# EAGLE schematic anchor (EAGLE 6.5.0)
AUTHOR: Brad Campbell; REV: A; TITLE: PolyAnchor

## Sheet 1 of 2
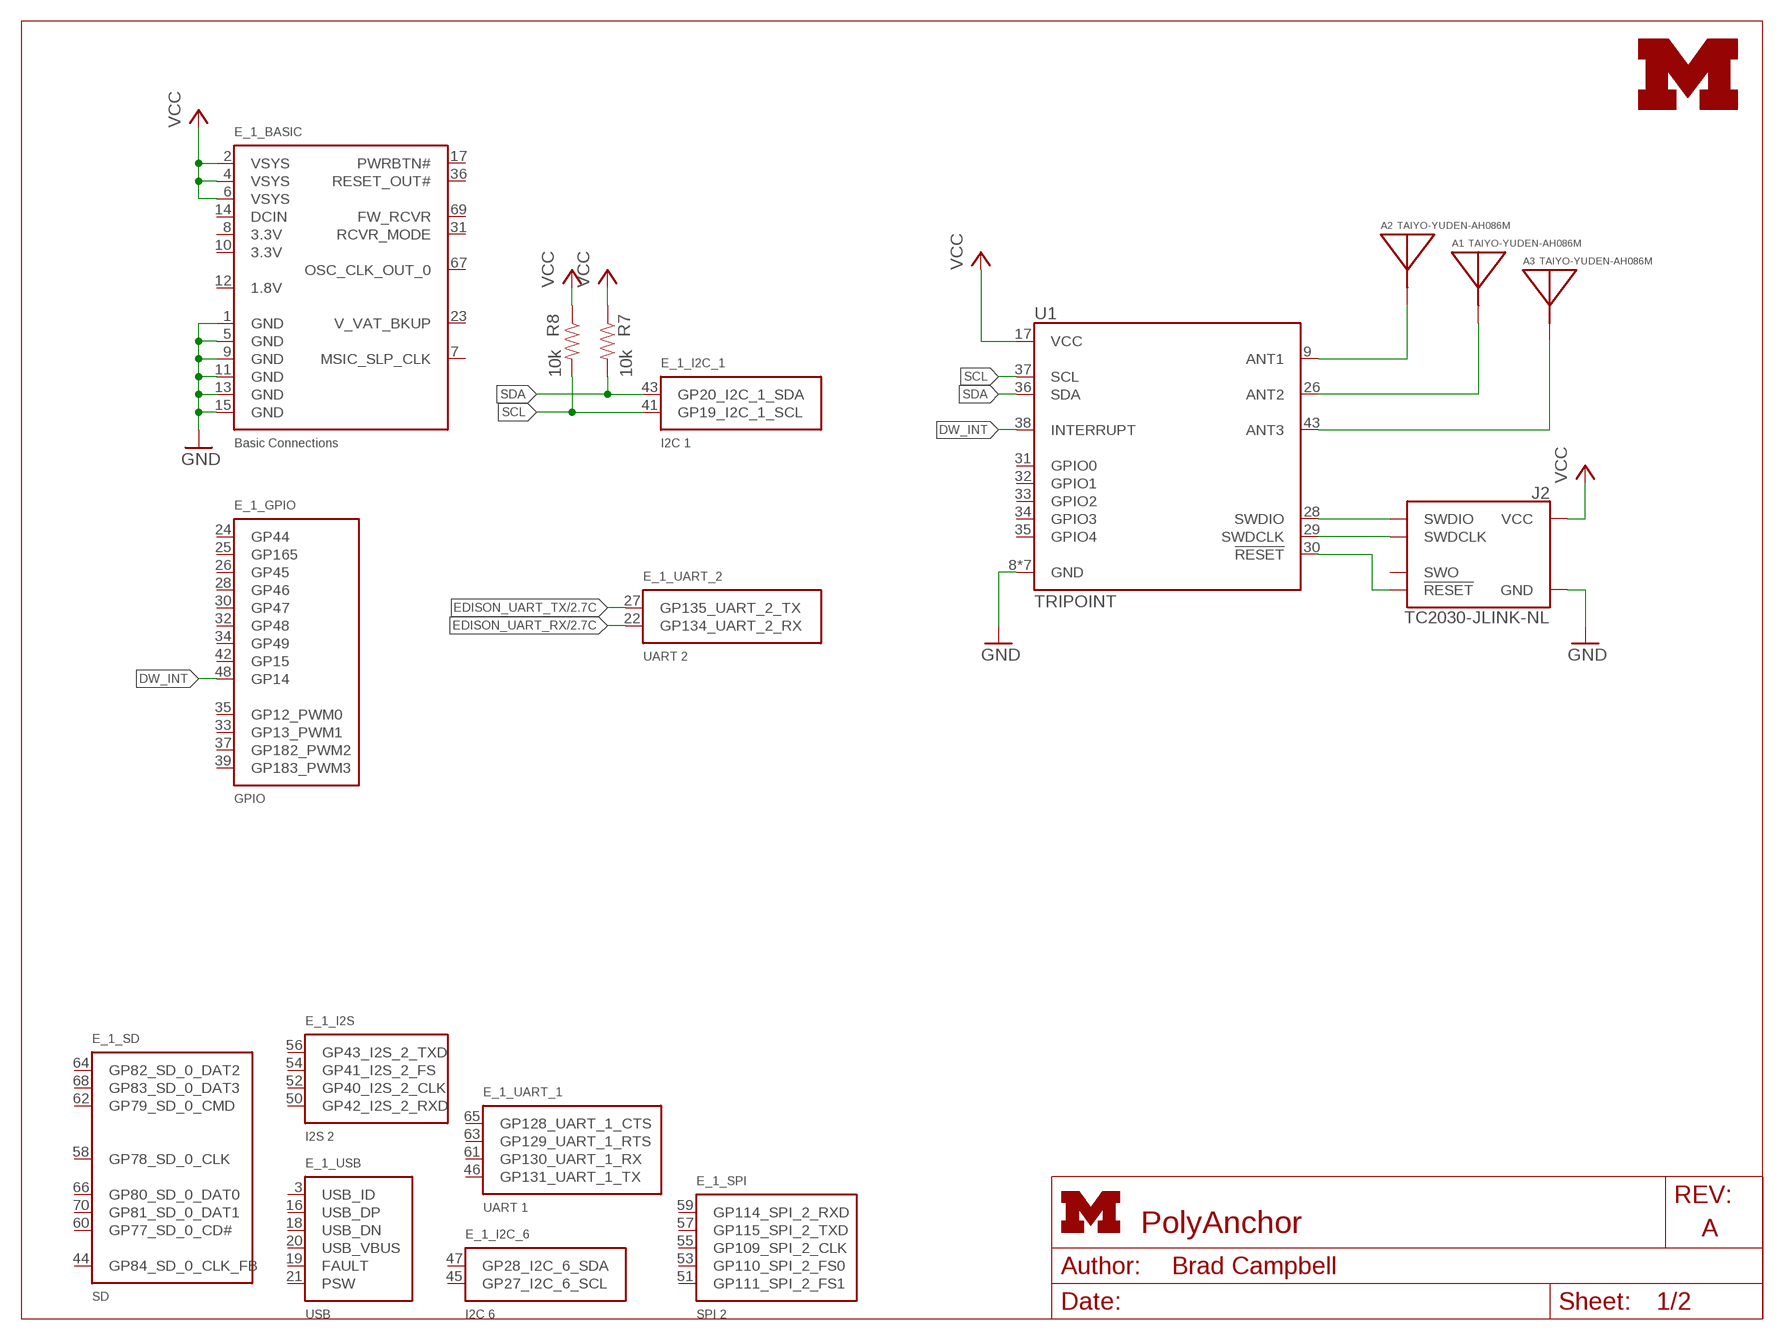
[diagram p0: schematic, sheet 1]
FRAME1 (LETTER_L): HEIGHT: 8.5in; WIDTH: 11in

### Parts
A1  TAIYO-YUDEN-AH086M  [TAIYO-YUDEN-AH086M]
A2  TAIYO-YUDEN-AH086M  [TAIYO-YUDEN-AH086M]
A3  TAIYO-YUDEN-AH086M  [TAIYO-YUDEN-AH086M]
E_1  EDISON_CONNECTOR_SEGMENTED  [EDISON_DAUGHTER]
J2  TC2030-JLINK-NL  [TC2030-IDC-NL]
LOGO1  UMICH_SOLID_MEDIUM  [UMICH_SOLID_200MIL]
R7  10k  RESISTOR0402_RES  [0402_RES]
R8  10k  RESISTOR0402_RES  [0402_RES]
U1  TRIPOINT  [TRIPOINT]

### Nets
DW_INT: E_1.48(_GPIO:GP14) U1.38(INTERRUPT)
EDISON_UART_RX: E_1.22(_UART_2:GP134_UART_2_RX) ; also sheet 2
EDISON_UART_TX: E_1.27(_UART_2:GP135_UART_2_TX) ; also sheet 2
GND: E_1.1(_BASIC:GND) E_1.5(_BASIC:GND) E_1.9(_BASIC:GND) E_1.11(_BASIC:GND) E_1.13(_BASIC:GND) E_1.15(_BASIC:GND) J2.5(GND) U1.8(GND) U1.10(GND) U1.18(GND) U1.25(GND) U1.27(GND) U1.42(GND) U1.44(GND) ; also sheet 2
N$5: J2.2(SWDIO) U1.28(SWDIO)
N$10: A2.A(ANTENNA) U1.9(ANT1)
N$11: A1.A(ANTENNA) U1.26(ANT2)
N$12: A3.A(ANTENNA) U1.43(ANT3)
N$13: J2.4(SWDCLK) U1.29(SWDCLK)
N$14: J2.3(!RESET) U1.30(!RESET)
SCL: E_1.41(_I2C_1:GP19_I2C_1_SCL) R8.2 U1.37(SCL)
SDA: E_1.43(_I2C_1:GP20_I2C_1_SDA) R7.2 U1.36(SDA)
VCC: E_1.2(_BASIC:VSYS) E_1.4(_BASIC:VSYS) E_1.6(_BASIC:VSYS) J2.1(VCC) R7.1 R8.1 U1.17(VCC) ; also sheet 2
Unconnected: E_1.3(_USB:USB_ID) E_1.7(_BASIC:MSIC_SLP_CLK) E_1.8(_BASIC:3.3V) E_1.10(_BASIC:3.3V) E_1.12(_BASIC:1.8V) E_1.14(_BASIC:DCIN) E_1.16(_USB:USB_DP) E_1.17(_BASIC:PWRBTN#) E_1.18(_USB:USB_DN) E_1.19(_USB:FAULT) E_1.20(_USB:USB_VBUS) E_1.21(_USB:PSW) E_1.23(_BASIC:V_VAT_BKUP) E_1.24(_GPIO:GP44) E_1.25(_GPIO:GP165) E_1.26(_GPIO:GP45) E_1.28(_GPIO:GP46) E_1.30(_GPIO:GP47) E_1.31(_BASIC:RCVR_MODE) E_1.32(_GPIO:GP48) E_1.33(_GPIO:GP13_PWM1) E_1.34(_GPIO:GP49) E_1.35(_GPIO:GP12_PWM0) E_1.36(_BASIC:RESET_OUT#) E_1.37(_GPIO:GP182_PWM2) E_1.39(_GPIO:GP183_PWM3) E_1.42(_GPIO:GP15) E_1.44(_SD:GP84_SD_0_CLK_FB) E_1.45(_I2C_6:GP27_I2C_6_SCL) E_1.46(_UART_1:GP131_UART_1_TX) E_1.47(_I2C_6:GP28_I2C_6_SDA) E_1.50(_I2S:GP42_I2S_2_RXD) E_1.51(_SPI:GP111_SPI_2_FS1) E_1.52(_I2S:GP40_I2S_2_CLK) E_1.53(_SPI:GP110_SPI_2_FS0) E_1.54(_I2S:GP41_I2S_2_FS) E_1.55(_SPI:GP109_SPI_2_CLK) E_1.56(_I2S:GP43_I2S_2_TXD) E_1.57(_SPI:GP115_SPI_2_TXD) E_1.58(_SD:GP78_SD_0_CLK) E_1.59(_SPI:GP114_SPI_2_RXD) E_1.60(_SD:GP77_SD_0_CD#) E_1.61(_UART_1:GP130_UART_1_RX) E_1.62(_SD:GP79_SD_0_CMD) E_1.63(_UART_1:GP129_UART_1_RTS) E_1.64(_SD:GP82_SD_0_DAT2) E_1.65(_UART_1:GP128_UART_1_CTS) E_1.66(_SD:GP80_SD_0_DAT0) E_1.67(_BASIC:OSC_CLK_OUT_0) E_1.68(_SD:GP83_SD_0_DAT3) E_1.69(_BASIC:FW_RCVR) E_1.70(_SD:GP81_SD_0_DAT1) J2.6(SWO) U1.31(GPIO0) U1.32(GPIO1) U1.33(GPIO2) U1.34(GPIO3) U1.35(GPIO4)

## Sheet 2 of 2
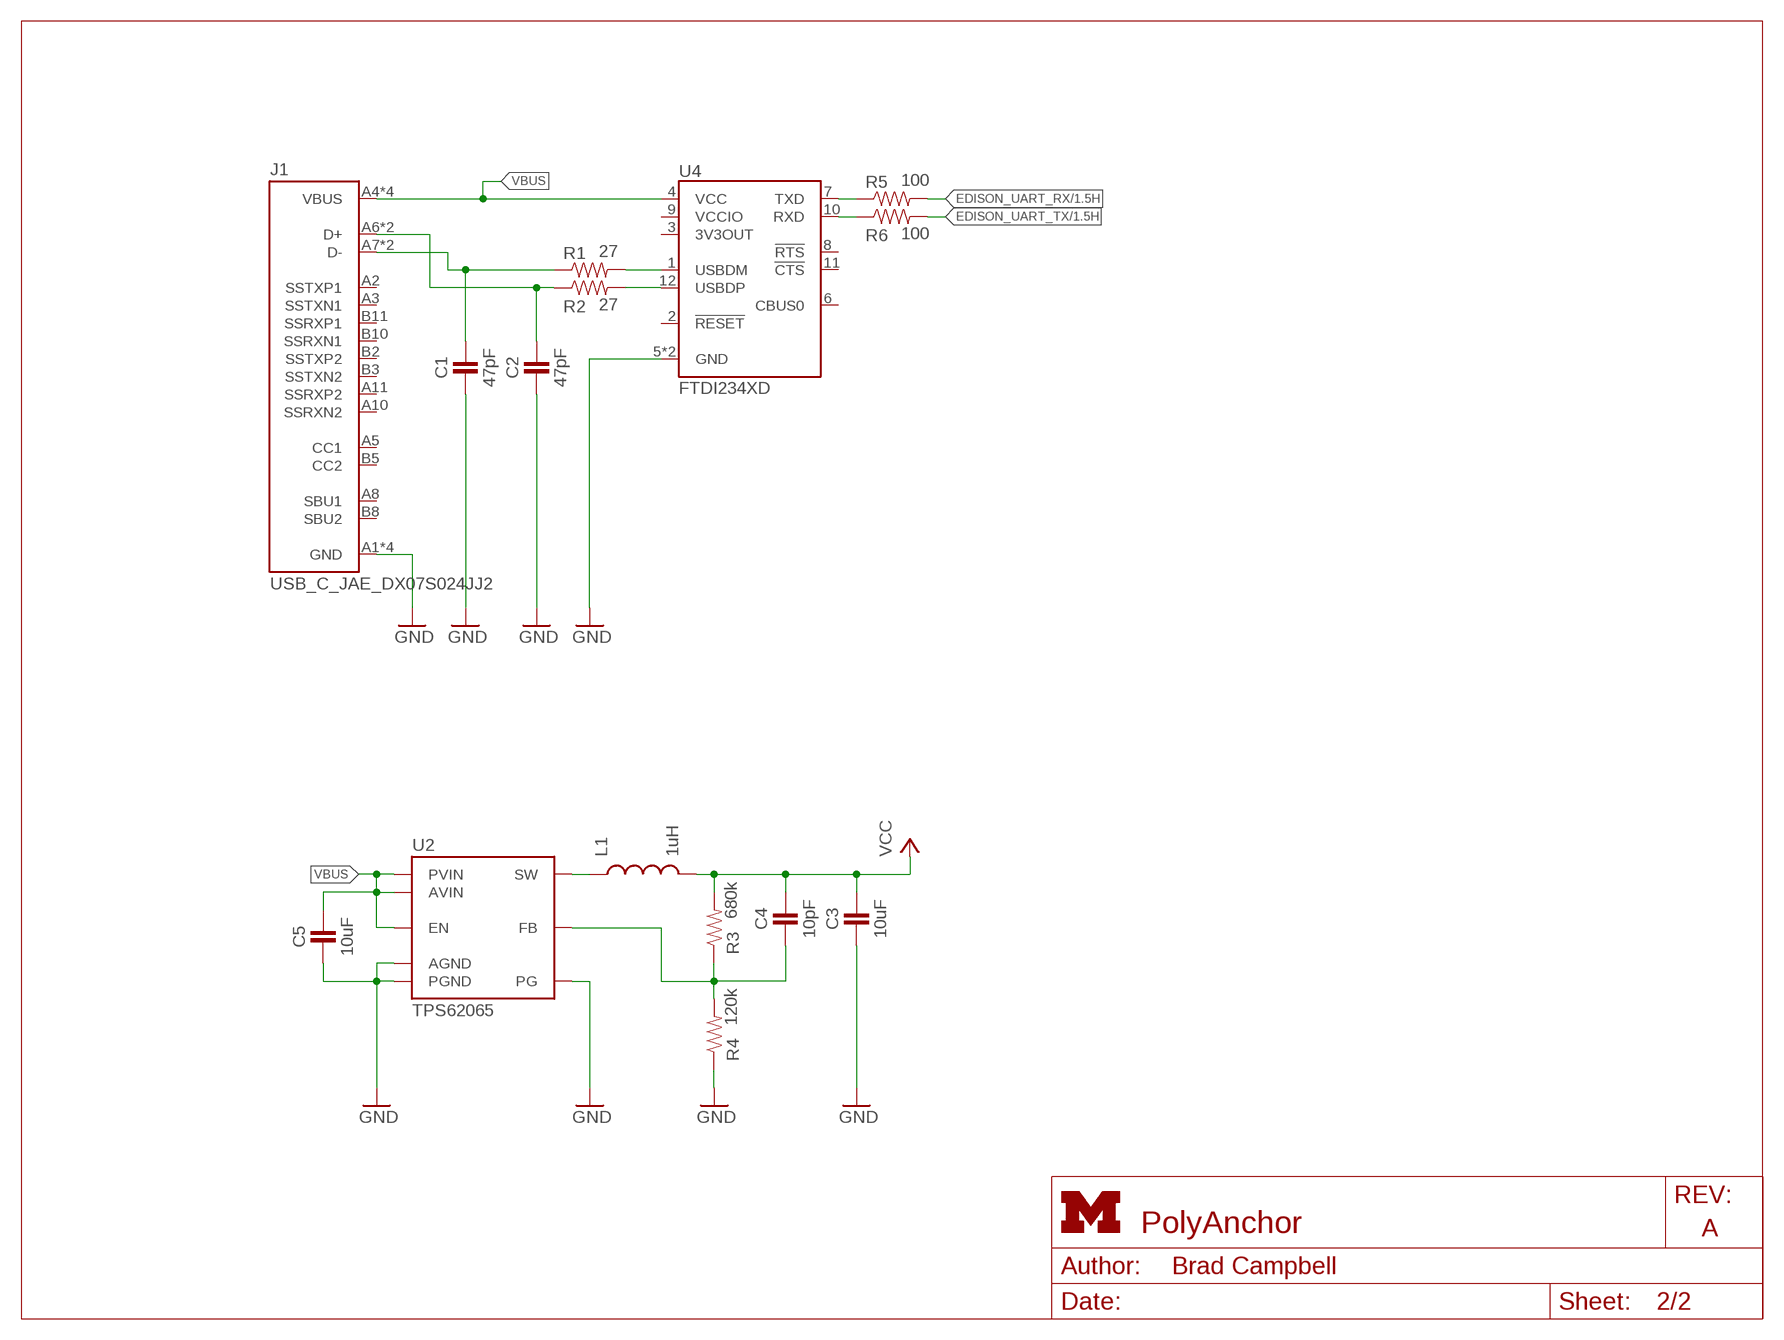
[diagram p1: schematic, sheet 2]
FRAME3 (LETTER_L): HEIGHT: 8.5in; WIDTH: 11in

### Parts
C1  47pF  CAPACITOR  [0402_CAP]
C2  47pF  CAPACITOR  [0402_CAP]
C3  10uF  CAPACITOR0603_CAP  [0603_CAP]
C4  10pF  CAPACITOR  [0402_CAP]
C5  10uF  CAPACITOR0603_CAP  [0603_CAP]
J1  USB_C_JAE_DX07S024JJ2  [DX07S024JJ2]
L1  1uH  INDUCTOR1210  [1210]
R1  27  RESISTOR0402_RES  [0402_RES]
R2  27  RESISTOR0402_RES  [0402_RES]
R3  680k  RESISTOR0402_RES  [0402_RES]
R4  120k  RESISTOR0402_RES  [0402_RES]
R5  100  RESISTOR0402_RES  [0402_RES]
R6  100  RESISTOR0402_RES  [0402_RES]
U2  TPS62065  [S-PWSON-N8]
U4  FTDI234XD  [DFN-12/3MM]

### Nets
D+: C2.1 J1.A6(D+) J1.B6(D+) R2.1
D-: C1.1 J1.A7(D-) J1.B7(D-) R1.1
EDISON_UART_RX: R5.2 ; also sheet 1
EDISON_UART_TX: R6.2 ; also sheet 1
GND: C1.2 C2.2 C3.2 C5.2 J1.A1(GND) J1.A12(GND) J1.B1(GND) J1.B12(GND) R4.1 U2.1(PGND) U2.3(AGND) U2.6(PG) U2.P$1(PGND) U4.5(GND) U4.13(GND) ; also sheet 1
N$1: L1.1 U2.2(SW)
N$2: R5.1 U4.7(TXD)
N$6: R1.2 U4.1(USBDM)
N$7: R2.2 U4.12(USBDP)
N$8: C4.2 R3.1 R4.2 U2.4(FB)
N$9: R6.1 U4.10(RXD)
VBUS: C5.1 J1.A4(VBUS) J1.A9(VBUS) J1.B4(VBUS) J1.B9(VBUS) U2.5(EN) U2.7(AVIN) U2.8(PVIN) U4.4(VCC)
VCC: C3.1 C4.1 L1.2 R3.2 ; also sheet 1
Unconnected: J1.A2(SSTXP1) J1.A3(SSTXN1) J1.A5(CC1) J1.A8(SBU1) J1.A10(SSRXN2) J1.A11(SSRXP2) J1.B2(SSTXP2) J1.B3(SSTXN2) J1.B5(CC2) J1.B8(SBU2) J1.B10(SSRXN1) J1.B11(SSRXP1) U4.2(!RESET) U4.3(3V3OUT) U4.6(CBUS0) U4.8(!RTS) U4.9(VCCIO) U4.11(!CTS)

## Library data of the parts
A1-A3 = chips:TAIYO-YUDEN-AH086M: UWB Antenna - 3.1-8GHz; DIGIKEY: 587-2204-1-ND
C1 C2 C4 = passives:CAPACITOR: 0402 Capacitor
C3 C5 = passives:CAPACITOR: 0402 Capacitor; DIGIKEY: 490-6405-1-ND
E_1 = Edison:EDISON_CONNECTOR_SEGMENTED
J1 = connector:USB_C_JAE_DX07S024JJ2: Surface mount USB-C; MOUSER: 656-DX07S024JJ2R1300
J2 = connector:TC2030-JLINK
L1 = SparkFun-Passives:INDUCTOR: Inductors Basic Inductor/Choke - 0603 and 1206. Footprints are not proven and vary greatly between part numbers.; DIGIKEY: 490-10767-1-ND
LOGO1 = logos:UMICH_SOLID
R1-R8 = passives:RESISTOR: Resistor Basic schematic elements and footprints for 0603, 1206, and PTH resistors.
U1 = tripoint:TRIPOINT: UWB Ranging Module
U2 = chips:TPS62065: Step down DC-DC converter.; DIGIKEY: 296-39441-1-ND
U4 = chips:FTDI234XD: FTDI234XD USB to UART Bridge in 3x3 DFN Package; DIGIKEY: 768-1178-1-ND; MOUSER: 895-FT234XD-R; NEWARK: 53X3171